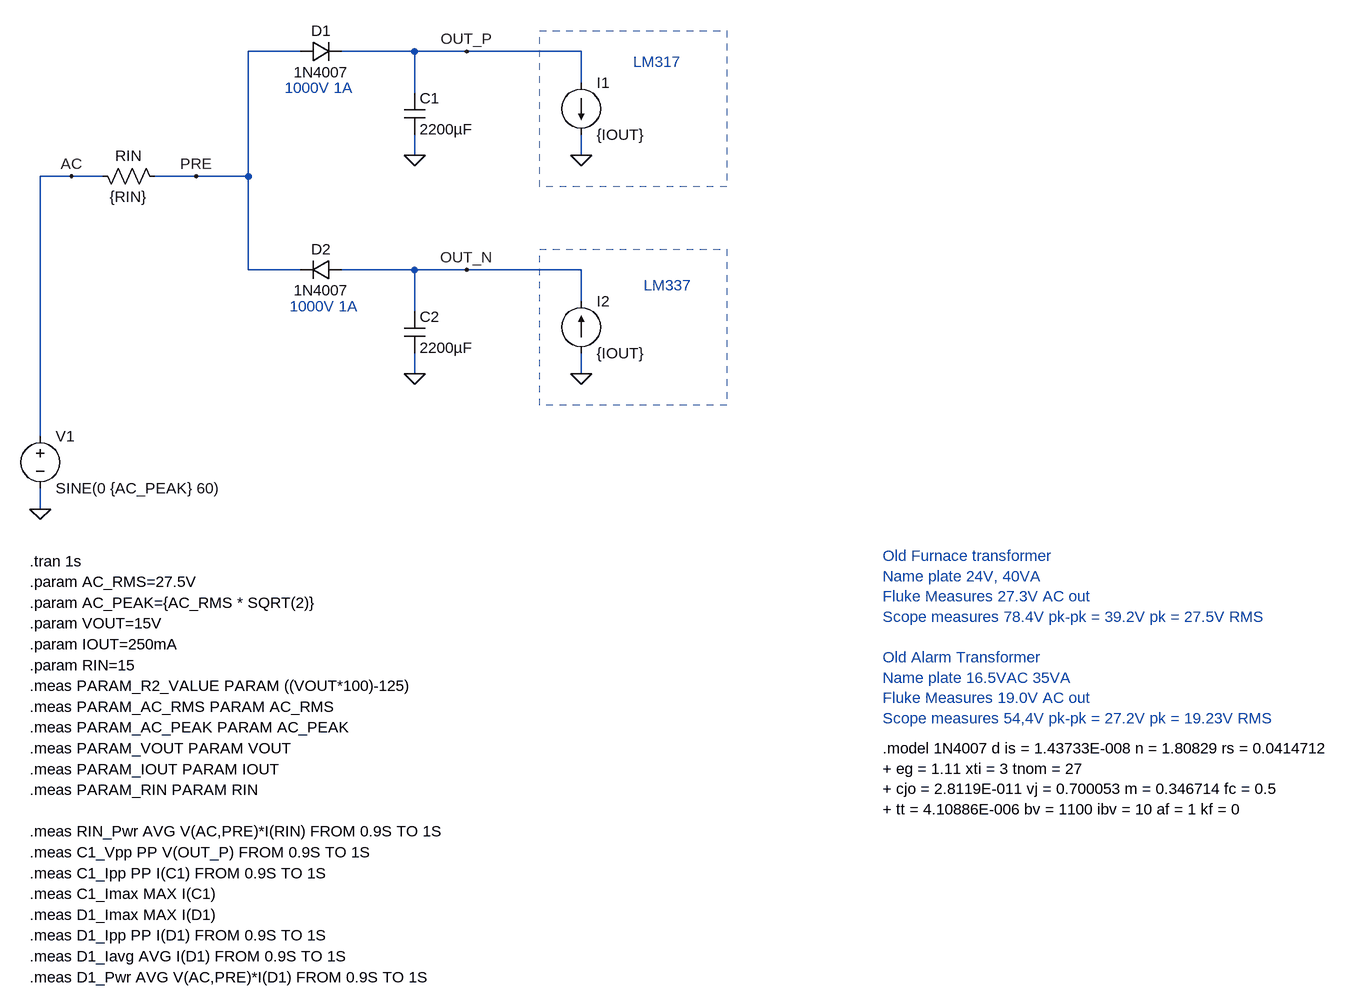
[diagram p0: schematic Parameteric Half-wave Rectifier with current source load.asc]
Parameteric Half-wave Rectifier with current source load.asc, the LTspice schematic file:
Version 4
SHEET 1 2092 1648
WIRE 208 -48 128 -48
WIRE 384 -48 272 -48
WIRE 464 -48 384 -48
WIRE 640 -48 464 -48
WIRE 640 0 640 -48
WIRE 384 16 384 -48
WIRE 384 112 384 80
WIRE 640 112 640 80
WIRE -144 144 -192 144
WIRE -96 144 -144 144
WIRE 48 144 -16 144
WIRE 128 144 128 -48
WIRE 128 144 48 144
WIRE 128 288 128 144
WIRE 208 288 128 288
WIRE 384 288 272 288
WIRE 464 288 384 288
WIRE 640 288 464 288
WIRE 640 336 640 288
WIRE 384 352 384 288
WIRE 384 448 384 416
WIRE 640 448 640 416
WIRE -192 544 -192 144
WIRE -192 656 -192 624
FLAG -192 656 0
FLAG 384 112 0
FLAG 464 -48 OUT_P
FLAG -144 144 AC
FLAG 48 144 PRE
FLAG 384 448 0
FLAG 464 288 OUT_N
FLAG 640 112 0
FLAG 640 448 0
SYMBOL voltage -192 528 R0
WINDOW 123 0 0 Left 0
WINDOW 39 0 0 Left 0
SYMATTR InstName V1
SYMATTR Value SINE(0 {AC_PEAK} 60)
SYMBOL cap 368 16 R0
SYMATTR InstName C1
SYMATTR Value 2200µF
SYMATTR SpiceLine V=50V Irms=3.375 Rser=60m
SYMBOL res -112 128 M90
WINDOW 0 0 56 VBottom 2
WINDOW 3 32 56 VTop 2
SYMATTR InstName RIN
SYMATTR Value {RIN}
SYMBOL diode 208 -32 R270
WINDOW 0 32 32 VTop 2
WINDOW 3 0 32 VBottom 2
SYMATTR InstName D1
SYMATTR Value 1N4007
SYMBOL cap 368 352 R0
SYMATTR InstName C2
SYMATTR Value 2200µF
SYMATTR SpiceLine V=50V Irms=3.375 Rser=60m
SYMBOL diode 272 304 M270
WINDOW 0 32 32 VTop 2
WINDOW 3 0 32 VBottom 2
SYMATTR InstName D2
SYMATTR Value 1N4007
SYMBOL current 640 0 R0
SYMATTR InstName I1
SYMATTR Value {IOUT}
SYMBOL current 640 416 M180
WINDOW 0 24 80 Left 2
WINDOW 3 24 0 Left 2
SYMATTR InstName I2
SYMATTR Value {IOUT}
TEXT 184 8 Left 2 ;1000V 1A
TEXT -208 736 Left 2 !.tran 1s
TEXT -208 768 Left 2 !.param AC_RMS=27.5V
TEXT -208 800 Left 2 !.param AC_PEAK={AC_RMS * SQRT(2)}
TEXT -208 832 Left 2 !.param VOUT=15V
TEXT -208 864 Left 2 !.param IOUT=250mA
TEXT -208 896 Left 2 !.param RIN=15
TEXT -208 928 Left 2 !.meas PARAM_R2_VALUE PARAM ((VOUT*100)-125)
TEXT -208 960 Left 2 !.meas PARAM_AC_RMS PARAM AC_RMS
TEXT -208 992 Left 2 !.meas PARAM_AC_PEAK PARAM AC_PEAK
TEXT -208 1024 Left 2 !.meas PARAM_VOUT PARAM VOUT
TEXT -208 1056 Left 2 !.meas PARAM_IOUT PARAM IOUT
TEXT -208 1088 Left 2 !.meas PARAM_RIN PARAM RIN
TEXT -208 1152 Left 2 !.meas RIN_Pwr AVG V(AC,PRE)*I(RIN) FROM 0.9S TO 1S
TEXT -208 1184 Left 2 !.meas C1_Vpp PP V(OUT_P) FROM 0.9S TO 1S
TEXT -208 1216 Left 2 !.meas C1_Ipp PP I(C1) FROM 0.9S TO 1S
TEXT -208 1248 Left 2 !.meas C1_Imax MAX I(C1)
TEXT -208 1280 Left 2 !.meas D1_Imax MAX I(D1)
TEXT -208 1312 Left 2 !.meas D1_Ipp PP I(D1) FROM 0.9S TO 1S
TEXT -208 1376 Left 2 !.meas D1_Pwr AVG V(AC,PRE)*I(D1) FROM 0.9S TO 1S
TEXT -208 1344 Left 2 !.meas D1_Iavg AVG I(D1) FROM 0.9S TO 1S
TEXT 1104 728 Left 2 ;Old Furnace transformer\nName plate 24V, 40VA\nFluke Measures 27.3V AC out\nScope measures 78.4V pk-pk = 39.2V pk = 27.5V RMS\n \nOld Alarm Transformer\nName plate 16.5VAC 35VA\nFluke Measures 19.0V AC out\nScope measures 54,4V pk-pk = 27.2V pk = 19.23V RMS
TEXT 1104 1024 Left 2 !.model 1N4007 d is = 1.43733E-008 n = 1.80829 rs = 0.0414712\n+ eg = 1.11 xti = 3 tnom = 27\n+ cjo = 2.8119E-011 vj = 0.700053 m = 0.346714 fc = 0.5\n+ tt = 4.10886E-006 bv = 1100 ibv = 10 af = 1 kf = 0
TEXT 192 344 Left 2 ;1000V 1A
TEXT 720 -32 Left 2 ;LM317
TEXT 736 312 Left 2 ;LM337
RECTANGLE Normal 864 160 576 -80 1
RECTANGLE Normal 864 496 576 256 1

The netlist it stands for:
* Parameteric Half-wave Rectifier with current source load.asc
V1 AC 0 SINE(0 {AC_PEAK} 60)
C1 OUT_P 0 2200µF V=50V Irms=3.375 Rser=60m
RIN AC PRE {RIN}
D1 PRE OUT_P 1N4007
C2 OUT_N 0 2200µF V=50V Irms=3.375 Rser=60m
D2 OUT_N PRE 1N4007
I1 OUT_P 0 {IOUT}
I2 0 OUT_N {IOUT}
.model D D
.lib standard.dio
* 1000V 1A
.tran 1s
.param AC_RMS=27.5V
.param AC_PEAK={AC_RMS * SQRT(2)}
.param VOUT=15V
.param IOUT=250mA
.param RIN=15
.meas PARAM_R2_VALUE PARAM ((VOUT*100)-125)
.meas PARAM_AC_RMS PARAM AC_RMS
.meas PARAM_AC_PEAK PARAM AC_PEAK
.meas PARAM_VOUT PARAM VOUT
.meas PARAM_IOUT PARAM IOUT
.meas PARAM_RIN PARAM RIN
.meas RIN_Pwr AVG V(AC,PRE)*I(RIN) FROM 0.9S TO 1S
.meas C1_Vpp PP V(OUT_P) FROM 0.9S TO 1S
.meas C1_Ipp PP I(C1) FROM 0.9S TO 1S
.meas C1_Imax MAX I(C1)
.meas D1_Imax MAX I(D1)
.meas D1_Ipp PP I(D1) FROM 0.9S TO 1S
.meas D1_Pwr AVG V(AC,PRE)*I(D1) FROM 0.9S TO 1S
.meas D1_Iavg AVG I(D1) FROM 0.9S TO 1S
* Old Furnace transformer
* Name plate 24V, 40VA
* Fluke Measures 27.3V AC out
* Scope measures 78.4V pk-pk = 39.2V pk = 27.5V RMS
* Old Alarm Transformer
* Name plate 16.5VAC 35VA
* Fluke Measures 19.0V AC out
* Scope measures 54,4V pk-pk = 27.2V pk = 19.23V RMS
.model 1N4007 d is = 1.43733E-008 n = 1.80829 rs = 0.0414712
+ eg = 1.11 xti = 3 tnom = 27
+ cjo = 2.8119E-011 vj = 0.700053 m = 0.346714 fc = 0.5
+ tt = 4.10886E-006 bv = 1100 ibv = 10 af = 1 kf = 0
* 1000V 1A
* LM317
* LM337
.backanno
.end